# EAGLE design Qwiic_Differential_Pressure_Sensor-SDP31 (EAGLE 9.6.2)
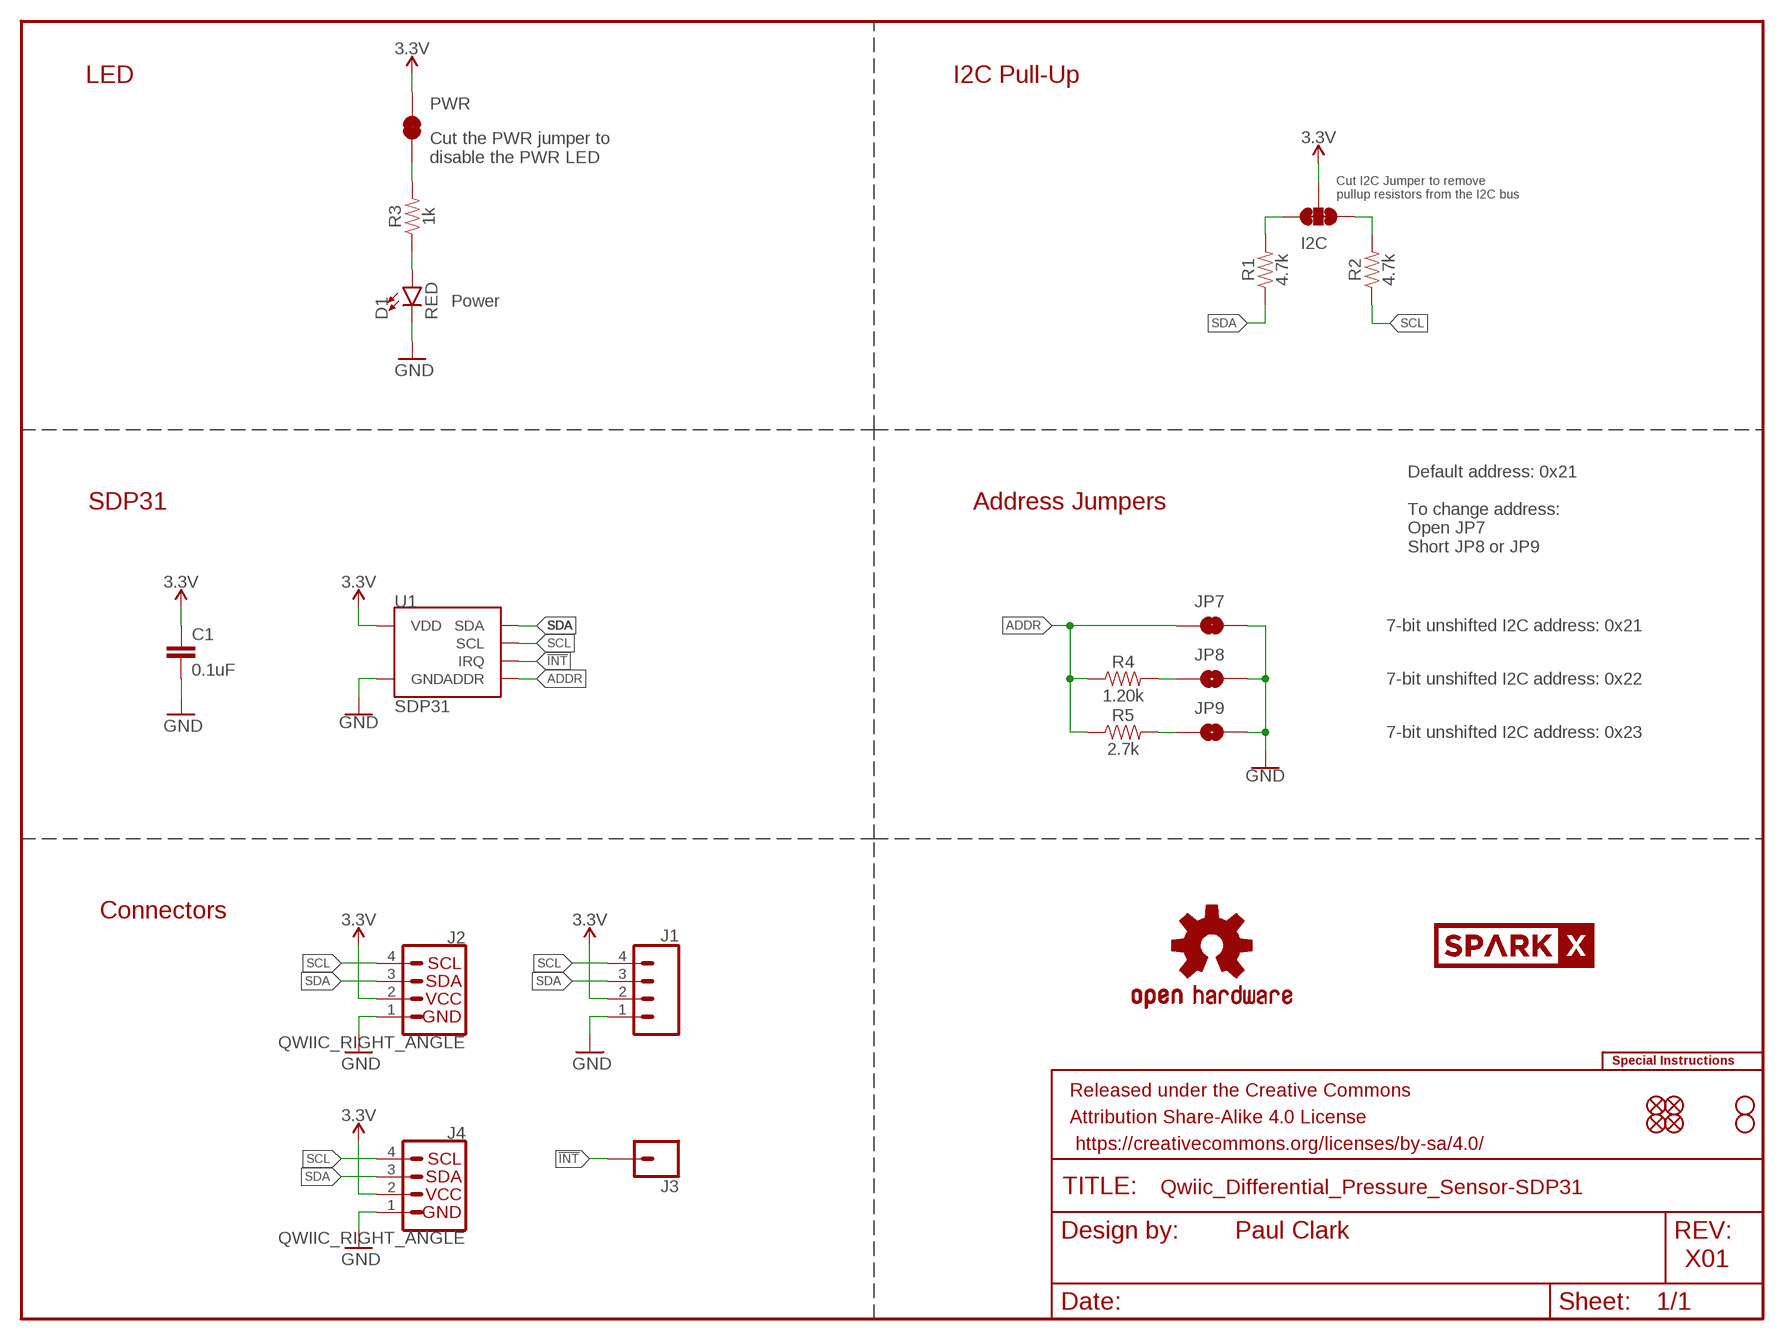
[diagram p0: schematic, sheet 1]

## Parts
C1  0.1uF  0.1UF-0603-25V-(+80/-20%)  [0603]
D1  RED  LED-RED0603  [LED-0603]
FRAME1  FRAME-LETTER  [CREATIVE_COMMONS]
I2C  JUMPER-SMT_3_2-NC_TRACE_SILK  [SMT-JUMPER_3_2-NC_TRACE_SILK]
J1  CONN_041X04_NO_SILK  [1X04_NO_SILK]
J2  QWIIC_RIGHT_ANGLE  QWIIC_CONNECTORJS-1MM  [JST04_1MM_RA]
J3  CONN_01PTH_NO_SILK_YES_STOP  [1X01_NO_SILK]
J4  QWIIC_RIGHT_ANGLE  QWIIC_CONNECTORJS-1MM  [JST04_1MM_RA]
JP1  FIDUCIALUFIDUCIAL  [FIDUCIAL-MICRO]
JP2  FIDUCIALUFIDUCIAL  [FIDUCIAL-MICRO]
JP3  STAND-OFF  [STAND-OFF]
JP4  STAND-OFF  [STAND-OFF]
JP5  FIDUCIALUFIDUCIAL  [FIDUCIAL-MICRO]
JP6  FIDUCIALUFIDUCIAL  [FIDUCIAL-MICRO]
JP7  JUMPER-SMT_2_NC_TRACE_SILK  [SMT-JUMPER_2_NC_TRACE_SILK]
JP8  JUMPER-SMT_2_NO_SILK  [SMT-JUMPER_2_NO_SILK]
JP9  JUMPER-SMT_2_NO_SILK  [SMT-JUMPER_2_NO_SILK]
LOGO1  SPECIAL_INSTRUCTIONS-ORDERING  [ORDERING_INSTRUCTIONS]
LOGO5  OSHW-LOGOS  [OSHW-LOGO-S]
PWR  JUMPER-SMT_2_NC_TRACE_SILK  [SMT-JUMPER_2_NC_TRACE_SILK]
R1  4.7k  4.7KOHM-0603-1/10W-1%  [0603]
R2  4.7k  4.7KOHM-0603-1/10W-1%  [0603]
R3  1k  1KOHM-0603-1/10W-1%  [0603]
R4  1.20k  1.20KOHM-0603-1/10W-1%  [0603]
R5  2.7k  2.7KOHM-0603-1/10W-1%  [0603]
U1  SDP31  SDP3X_SDP31  [SDP3X]
U$18  SPARKX-LOGO3  [SPARKX-SMALL]

## Nets
3.3V: C1.1 I2C.2 J1.2 J2.2 J4.2 PWR.2 U1.7(VDD)
!INT!: J3.1 U1.4(IRQ)
ADDR: JP7.1 R4.1 R5.1 U1.9(ADDR)
GND: C1.2 D1.C J1.1 J2.1 J4.1 JP7.2 JP8.2 JP9.2 U1.1(GND) U1.2(GND) U1.3(GND) U1.6(GND) U1.10(GND) U1.11(GND) U1.DIEPAD1(GND) U1.DIEPAD2(GND)
N$1: PWR.1 R3.2
N$2: I2C.3 R1.2
N$3: D1.A R3.1
N$4: I2C.1 R2.2
N$5: JP8.1 R4.2
N$6: JP9.1 R5.2
SCL: J1.4 J2.4 J4.4 R2.1 U1.5(SCL)
SDA: J1.3 J2.3 J4.3 R1.1 U1.8(SDA)

## Notes on the sheet
- LED | I2C Pull-Up
- Cut the PWR jumper to
  disable the PWR LED
- Cut I2C Jumper to remove 
  pullup resistors from the I2C bus
- Power
- Default address: 0x21
  
  To change address:
  Open JP7
  Short JP8 or JP9
- SDP31 | Address Jumpers
- 7-bit unshifted I2C address: 0x21
- 7-bit unshifted I2C address: 0x22
- 7-bit unshifted I2C address: 0x23
- Connectors
- Paul Clark
- X01

## Library data of the parts
C1 = SparkFun-Capacitors:0.1UF: 0.1µF ceramic capacitors A capacitor is a passive two-terminal electrical component used to store electrical energy temporarily in an electric field.; PROD_ID: CAP-00810
D1 = SparkFun-LED:LED-RED: Red SMD LED Used in manufacturing of most products at SparkFun Packages: 0603 - SMD 0603 package [Product Link] <http://docs.avagotech.com/docs/AV02-0551EN> 0603 SMART - SMD 0603 SMART package ( more efficient and expensive)[Product Link] <http://www.osram-os.com/Graphics/XPic2/00077099_0.pdf> 1206 - SMD1206 package [Product Link] <https://www.sparkfun.com/datasheets/DevTools/LilyPad/Q150OVS4.pdff> SparkFun Products: Pro Mini 328 -5V <https://www.sparkfun.com/products/821> RedBoard <https://www.sparkfun.com/products/12757> IOIO-OTG <https://www.sparkfun.com/products/13613>; PROD_ID: DIO-00819
FRAME1 = SparkFun-Aesthetics:FRAME-LETTER: Schematic Frame - Letter Standard 8.5x11 US Letter frame
I2C = SparkFun-Jumpers:JUMPER-SMT_3_2-NC_TRACE: Normally closed trace jumper (2 of 2 connections) This jumper has a trace between all three pads so they are normally closed (NC). Use a razor knife to open the connection(s). For best results follow the IPC guidelines for cutting traces: Cutout at least 0.063 mm (0.005 in). Remove all loose material to clean up the cut area. Seal the cut with an approved epoxy. Reapply solder to reclose the connection(s).
J1 = SparkFun-Connectors:CONN_04: Multi connection point. Often used as Generic Header-pin footprint for 0.1 inch spaced/style header connections On any of the 0.1 inch spaced packages, you can populate with these: Break Away Headers - Straight <https://www.sparkfun.com/products/116> (PRT-00116) Break Away Male Headers - Right Angle <https://www.sparkfun.com/products/553> (PRT-00553) Female Headers <https://www.sparkfun.com/products/115> (PRT-00115) Break Away Headers - Machine Pin <https://www.sparkfun.com/products/117> (PRT-00117) Break Away Female Headers - Swiss Machine Pin <https://www.sparkfun.com/products/743> (PRT-00743) For SCREWTERMINALS and SPRING TERMINALS visit here: Screw Terimnals on SparkFun.com <https://www.sparkfun.com/search/results?term=Screw+Terminals> (5mm/3.5mm/2.54mm spacing) This device is also useful as a general connection point to wire up your design to another part of your project. Our various solder wires solder well into these plated through hole pads. Hook-Up Wire - Assortment (Stranded, 22 AWG) <https://www.sparkfun.com/products/11375> (PRT-11375) Hook-Up Wire - Assortment (Solid Core, 22 AWG) <https://www.sparkfun.com/products/11367> (PRT-11367) View the entire wire category on our website here <https://www.sparkfun.com/categories/141> Special notes: Molex polarized connector foot print use with SKU : PRT-08231 with associated crimp pins and housings. 1MM SMD Version SKU: PRT-10208; PROD_ID: CONN-09696
J2 J4 = SparkFun-Connectors:QWIIC_CONNECTOR: SparkFun I2C Standard Qwiic Connector An SMD 1mm pitch JST connector makes it easy and quick (get it? Qwiic?) to connect I2C devices to each other. The Qwiic system <http://www.sparkfun.com/qwiic> enables fast and solderless connection between popular platforms and various sensors and actuators. We carry 200mm <https://www.sparkfun.com/products/14204>, 100mm <https://www.sparkfun.com/products/14205>, 50mm <https://www.sparkfun.com/products/14206>, and breadboard friendly <https://www.sparkfun.com/products/14207> Qwiic cables. We also offer 10 pcs strips <https://www.sparkfun.com/products/14323> the SMD connectors.; PROD_ID: CONN-13694
J3 = SparkFun-Connectors:CONN_01: Single connection point. Often used as Generic Header-pin footprint for 0.1 inch spaced/style header connections On any of the 0.1 inch spaced packages, you can populate with these: Break Away Headers - Straight <https://www.sparkfun.com/products/116> (PRT-00116) Break Away Male Headers - Right Angle <https://www.sparkfun.com/products/553> (PRT-00553) Female Headers <https://www.sparkfun.com/products/115> (PRT-00115) Break Away Headers - Machine Pin <https://www.sparkfun.com/products/117> (PRT-00117) Break Away Female Headers - Swiss Machine Pin <https://www.sparkfun.com/products/743> (PRT-00743) This device is also useful as a general connection point to wire up your design to another part of your project. Our various solder wires solder well into these plated through hole pads. Hook-Up Wire - Assortment (Stranded, 22 AWG) <https://www.sparkfun.com/products/11375> (PRT-11375) Hook-Up Wire - Assortment (Solid Core, 22 AWG) <https://www.sparkfun.com/products/11367> (PRT-11367) View the entire wire category on our website here <https://www.sparkfun.com/categories/141> Special notes: SMTSO-256-ET is a "flush mount" nut for a 4-40 screw. We mostly use this on specialty testbeds; it is a nice way to connect hardware to your PCB at an adjustable hieght. Also note, the SNAP packages are for using a snappable style connector. We sell a baggie of snaps and they are also used on two LilyPad designs: Snap Assortment - 30 pack (male and female) <https://www.sparkfun.com/products/11347> (DEV-11347) LilyPad Arduino SimpleSnap <https://www.sparkfun.com/products/10941> (DEV-10941) LilyPad SimpleSnap Protoboard <https://www.sparkfun.com/products/10940> (DEV-10940)
JP1 JP2 JP5 JP6 = SparkFun-Aesthetics:FIDUCIAL: Fiducial Alignment Points Point-of-reference for pick-and-place machines and other optical instruments.
JP3 JP4 = SparkFun-Hardware:STAND-OFF: Stand Off Drill holes for mechanically mounting via screws, standoffs, etc. Note: Use the keepout ring to avoid running the screw head into surrounding components. Variant Overviews STAND-OFF - Mechanical footprint for a #4 phillips button head screw. STAND-OFF-TIGHT - Mechanical footprint for a #4 phillips button head screw, Example SparkFun Products Screw - Phillips Head (1/4", 4-40, 10 pack) <https://www.sparkfun.com/products/10453> (PRT-10453) Screw - Phillips Head (1/2", 4-40, 10 pack) <https://www.sparkfun.com/products/10452> (PRT-10452) Screw - Phillips Head (3/4", 4-40, 10 pack) <https://www.sparkfun.com/products/10451> (PRT-10451) Screw - Phillips Head (1", 4-40, 10 pack) <https://www.sparkfun.com/products/10450> (PRT-10450)
JP7 PWR = SparkFun-Jumpers:JUMPER-SMT_2_NC_TRACE: Normally closed trace jumper This jumper has a trace between two pads so it's normally closed (NC). Use a razor knife to open the connection. For best results follow the IPC guidelines for cutting traces: Cutout at least 0.063 mm (0.005 in). Remove all loose material to clean up the cut area. Seal the cut with an approved epoxy. Reapply solder to reclose the connection.
JP8 JP9 = SparkFun-Jumpers:JUMPER-SMT_2_NO: Normally open jumper This jumper has two pads in close proximity to each other. Apply solder to close the connection. Round pads are easier to solder for beginners, but are a lot larger. SparkFun Product that uses the round pads: SparkFun EL Sequencer <https://www.sparkfun.com/products/12781>
LOGO1 = SparkFun-Aesthetics:SPECIAL_INSTRUCTIONS: Special Ordering/Production Instructions Alert Symbol for special PCB ordering instructions or unique production process warnings. Ordering Instructions Production Instructions Types of information that should be added to box: Copper weight Soldermask color Silk color PCB thickness Number of layers PCB Standard: 1.6mm FR4 1 oz copper immersion silver plating red soldermask white silkscreen Types of information that should be added to box: Special wash requirements Depaneling instructions Humidification Glue curing Default text settings: 0.07 inch 9% ratio 50% line distance
LOGO5 = SparkFun-Aesthetics:OSHW-LOGO: Open-Source Hardware (OSHW) Logo This logo indicates the piece of hardware it is found on incorporates a OSHW license and/or adheres to the definition of open source hardware found here: http://freedomdefined.org/OSHW
R1 R2 = SparkFun-Resistors:4.7KOHM: 4.7kΩ resistor A resistor is a passive two-terminal electrical component that implements electrical resistance as a circuit element. Resistors act to reduce current flow, and, at the same time, act to lower voltage levels within circuits. - Wikipedia; PROD_ID: RES-07857
R3 = SparkFun-Resistors:1KOHM: 1kΩ resistor A resistor is a passive two-terminal electrical component that implements electrical resistance as a circuit element. Resistors act to reduce current flow, and, at the same time, act to lower voltage levels within circuits. - Wikipedia; PROD_ID: RES-07856
R4 = SparkFun-Resistors:1.20KOHM: 1.20kΩ resistor A resistor is a passive two-terminal electrical component that implements electrical resistance as a circuit element. Resistors act to reduce current flow, and, at the same time, act to lower voltage levels within circuits. - Wikipedia; PROD_ID: RES-08413
R5 = SparkFun-Resistors:2.7KOHM: 2.7kΩ resistor A resistor is a passive two-terminal electrical component that implements electrical resistance as a circuit element. Resistors act to reduce current flow, and, at the same time, act to lower voltage levels within circuits. - Wikipedia; PROD_ID: RES-16714
U1 = SparkFun-Sensors:SDP3X: Differential Pressure Sensor SDP3x The World's Smallest Differential Pressure Sensor The SDP3x is the world's smallest differential pressure sensor. It measures just 5 mm x 8 mm x 5 mm, opening up new dimensions of integration and application possibilities. The sensor is based on the next generation of the CMOSens® sensor chip and is the heart of Sensirion's new sensor platform for measuring differential pressure and mass flow.; PROD_ID: IC-15720
U$18 = SparkX:SPARKX-LOGO

## Net classes
1 power: width 0.203 mm

## Board
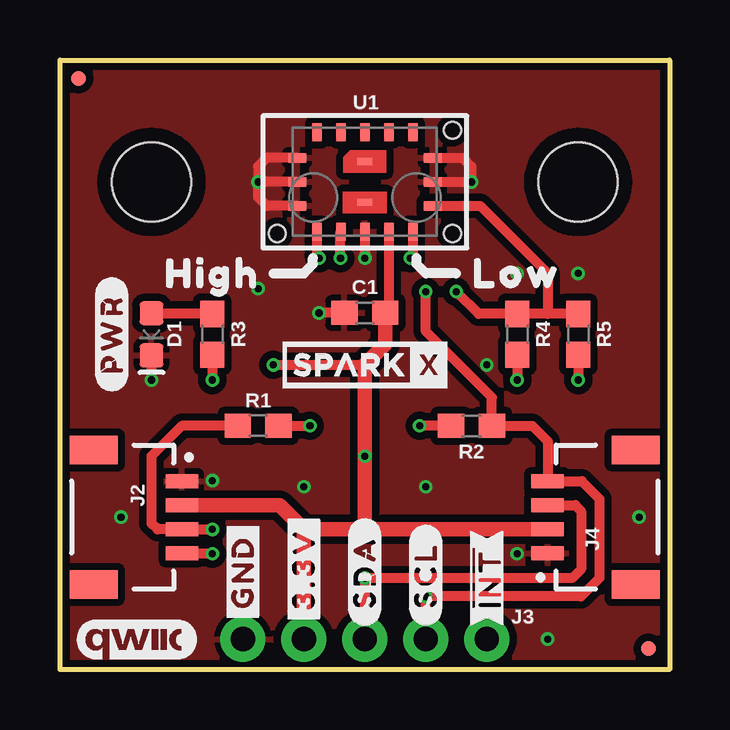
[diagram p1: board, top side]
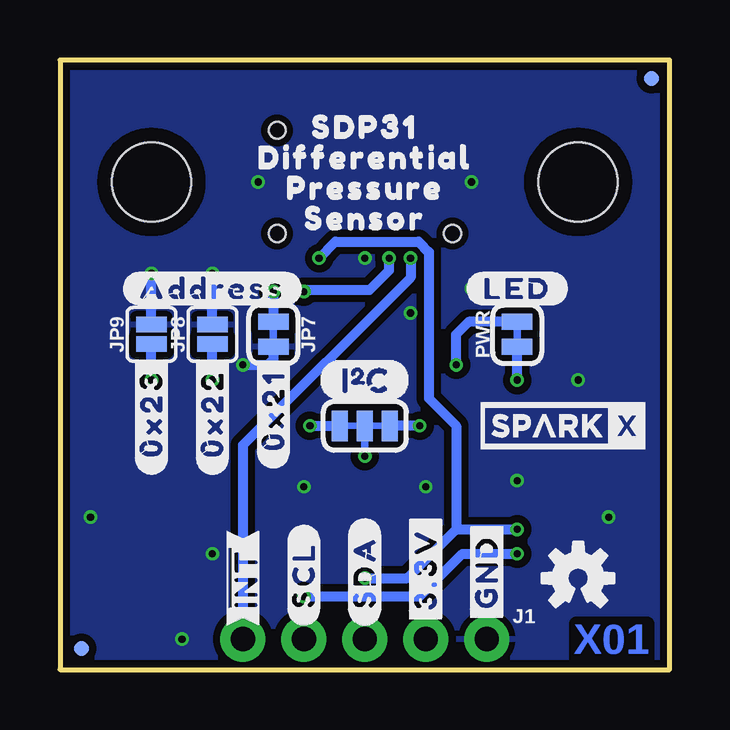
[diagram p2: board, bottom side, seen from below]

Size 25.4 x 25.4 mm. Coordinates in mm from the lower left corner, seen from the top.
Outline: 0,0 0,25.4 25.4,25.4 25.4,0 0,0
Copper layers (1+2*15+16): Top 0.035mm / dielectric 0.2mm / Route2 0.0175mm / dielectric 1.065mm / Route15 0.0175mm / dielectric 0.2mm / Bottom 0.035mm
Design rules "SparkFun-4-layer-1oz-JLCPCB": minimum track width 5mil, minimum drill 0.2mm, track to track 5mil, track to pad 0.2mm, pad to pad 5mil, via to via 0.2mm, smd to smd 0mil, copper to edge 0.2mm, drill to drill 10mil, minimum pad ring 0.13mm, minimum via ring 0.13mm, stop-mask expansion 0.05mm, vias tented up to drill 25mil, thermal gap 10mil

### Footprints (pad centres in the part's own frame; a part is rotated, then mirrored left to right if it is on the bottom)
0603 = smd 1.1 x 1: 1 -0.85,0; 2 0.85,0
LED-0603 = smd 1 x 1: A -0.877,0; C 0.877,0
SMT-JUMPER_3_2-NC_TRACE_SILK = smd 0.66 x 1.27: 1 -1.041,0; 2 0,0; 3 1.041,0
1X04_NO_SILK = drill 1.016 pad 1.88: 1 0,0; 2 2.54,0; 3 5.08,0; 4 7.62,0
JST04_1MM_RA = smd 0.6 x 1.35: 1 -1.5,0; 2 -0.5,0; 3 0.5,0; 4 1.5,0 | smd 1.2 x 2: NC1 2.8,-3.675; NC2 -2.8,-3.675
1X01_NO_SILK = drill 1.016 pad 1.88: 1 0,0
FIDUCIAL-MICRO = smd 0.635 x 0.635: 1 0,0
STAND-OFF = hole 3.302: 0,0
SMT-JUMPER_2_NC_TRACE_SILK = smd 0.66 x 1.27: 1 -0.521,0; 2 0.521,0
SMT-JUMPER_2_NO_SILK = smd 0.635 x 1.27: 1 -0.406,0; 2 0.406,0
SDP3X = smd 0.75 x 0.4: 1 -2.825,1; 2 -2.825,0; 3 -2.825,-1; 9 2.825,-1; 10 2.825,0; 11 2.825,1 | smd 0.4 x 0.75: 4 -2,-2.075; 5 -1,-2.075; 6 0,-2.075; 7 1,-2.075; 8 2,-2.075; 12 2,2.075; 13 1,2.075; 14 0,2.075; 15 -1,2.075; 16 -2,2.075 | smd 0.61 x 0.305: DIEPAD1 0,0.85; DIEPAD2 0,-0.85 | hole 0.7: -3.65,-2.15; 3.65,-2.15; 3.65,2.15

### Placement (x,y rotation side)
C1  12.7,14.86 180 top
D1  3.81,13.97 270 top
FRAME1  62.23,-13.97 0 top  (outside the outline)
I2C  12.7,10.16 0 bottom
J1  7.62,1.27 180 bottom
J2  5.08,6.35 270 top
J3  17.78,1.27 0 top
J4  20.32,6.35 90 top
JP1  0.76,24.64 0 bottom
JP2  24.51,0.89 0 top
JP3  3.81,20.32 0 top
JP4  21.59,20.32 0 top
JP5  24.51,0.89 0 bottom
JP6  0.76,24.64 0 top
JP7  16.51,13.97 270 bottom
JP8  19.05,13.97 90 bottom
JP9  21.59,13.97 90 bottom
LOGO1  41.91,45.72 0 top  (outside the outline)
LOGO5  3.81,3.81 0 bottom
PWR  6.35,13.97 90 bottom
R1  8.26,10.16 0 top
R2  17.14,10.16 180 top
R3  6.35,13.97 270 top
R4  19.05,13.97 270 top
R5  21.59,13.97 270 top
U1  12.7,20.32 0 top
U$1  [#GND#0]  7.62,4.06 90 bottom
U$2  [#3#3V#0]  10.16,4.19 90 bottom
U$3  [#SDA#0]  12.7,4.06 90 bottom
U$4  [#SCL#0]  15.24,3.94 90 bottom
U$5  [##INT##0]  17.78,3.81 90 top
U$6  [##INT##0]  17.78,3.81 90 bottom
U$7  [#0X21#0]  16.51,10.79 90 bottom
U$8  [#0X22#0]  19.05,10.67 90 bottom
U$9  [#0X23#0]  21.59,10.67 90 bottom
U$10  [DIFFERENTIAL0]  12.7,21.34 0 bottom
U$11  [PRESSURE0]  12.7,20.07 0 bottom
U$12  [SENSOR0]  12.7,18.8 0 bottom
U$13  [SDP310]  12.7,22.61 0 bottom
U$14  [#LED#0]  6.35,15.88 0 bottom
U$15  [I2C]  14.61,12.06 0 bottom
U$16  [QWIIC_5MM]  3.17,1.27 0 top
U$17  [HIGH0]  6.35,16.51 0 top
U$18  4.45,10.16 0 bottom
U$19  [LOW0]  19.05,16.51 0 top
U$20  SPARKX-LOGO3  [SPARKX-SMALL]  12.7,12.7 0 top
U$21  [#ADDRESS#0]  19.05,15.88 0 bottom
U$32  [#PWR#0]  2.16,13.97 90 top
U$33  [#GND#0]  7.62,4.06 90 top
U$34  [#3#3V#0]  10.16,4.19 90 top
U$35  [#SDA#0]  12.7,4.06 90 top
U$36  [#SCL#0]  15.24,3.94 90 top

### Tracks (layer width: path | path; a pad name or v marks a point on that pad's centre or on a via)
3.3V  (via drill 0.3)
  Top 0.406: v8.89,12.7 12.7,12.7 | U1.7 13.7,15.01 C1.1
  Top 0.61: J2.2 9.15,6.85 10.15,5.85 | 10.15,5.85 12.7,5.85 | 12.7,5.85 J4.2 | J1.2 10.16,5.84 10.15,5.85 | C1.1 13.55,13.55 12.7,12.7 v12.7,8.89 12.7,5.85
  Bottom 0.305: I2C.2 v12.7,8.89
  Bottom 0.406: PWR.2 8.37,14.49 8.89,13.97 v8.89,12.7
!INT!  (via drill 0.3)
  Top 0.406: U1.4 10.7,17.24 v10.79,17.14
  Bottom 0.406: J3.1 17.78,9.35 10.79,16.33 v10.79,17.14
ADDR  (via drill 0.3)
  Top 0.406: U1.9 17.51,19.32 20.32,16.51 20.32,14.82 | R5.1 20.32,14.82 | 20.32,14.82 R4.1 17.44,14.82 v16.51,15.75
  Bottom 0.406: v16.51,15.75 JP7.1
GND  (via drill 0.3)
  Top 0.406: U1.10 v17.14,20.32 17.14,20.95 16.78,21.32 U1.11 | U1.2 v8.26,20.32 | U1.1 8.62,21.32 8.26,20.95 v8.26,20.32 | U1.3 8.62,19.32 8.26,19.68 v8.26,20.32 | U1.6 v12.7,17.14 | D1.C v3.81,12.06 | C1.2 v10.79,14.86
  Bottom 0.406: JP8.2 v19.05,16.51 | JP9.2 v21.59,16.51 | v17.78,12.7 16.75,12.7 16.51,12.94 JP7.2
  other vias: 19.05,4.83 6.35,7.87 8.26,15.88 2.54,6.35 24.13,6.35 20.32,1.27 15.24,7.62 10.16,7.62
  pour Bottom (isolate 0.305): 0,0 0,25.4 25.4,25.4 25.4,0
  pour Top (isolate 0.305): 0,0 0,25.4 25.4,25.4 25.4,0
N$1  (via drill 0.3)
  Top 0.406: R3.2 v6.35,12.06
  Bottom 0.406: v6.35,12.06 PWR.1
N$2  (via drill 0.3)
  Top 0.406: R1.2 v10.41,10.16
  Bottom 0.406: v10.41,10.16 I2C.3
N$3
  Top 0.406: D1.A 6.32,14.85 R3.1
N$4  (via drill 0.3)
  Top 0.406: R2.2 v14.99,10.16
  Bottom 0.406: v14.99,10.16 I2C.1
N$5  (via drill 0.3)
  Top 0.406: R4.2 v19.05,12.06
  Bottom 0.406: v19.05,12.06 JP8.1
N$6  (via drill 0.3)
  Top 0.406: R5.2 v21.59,12.06
  Bottom 0.406: v21.59,12.06 JP9.1
SCL  (via drill 0.3)
  Top 0.406: v6.35,4.83 5.1,4.83 J2.4 | J1.4 v15.24,3.05 21.72,3.05 22.48,3.81 22.48,7.11 21.74,7.85 J4.4 20.32,9.53 19.68,10.16 R2.1 18,11.34 15.24,14.1 v15.24,15.75 | v11.68,17.14 11.68,18.23 U1.5
  Bottom 0.406: v15.24,3.05 10.41,3.05 8.64,4.83 v6.35,4.83 | v15.24,15.75 15.16,15.83 12.49,15.83 11.68,16.64 v11.68,17.14
SDA  (via drill 0.3)
  Top 0.305: J2.3
  Top 0.406: R1.1 5.08,10.16 3.81,8.89 3.81,6.1 4.06,5.84 J2.3 | J2.3 v6.34,5.85 v6.35,5.84 | J4.3 21.47,6.85 21.72,6.6 21.72,4.19 21.34,3.81 v12.7,3.81 J1.3 | U1.8 14.7,17.24 v14.61,17.14
  Bottom 0.406: v12.7,3.81 10.92,3.81 8.89,5.84 | 8.89,5.84 v6.35,5.84 | v14.61,17.14 13.92,17.83 10.46,17.83 10.03,17.4 10.03,11.3 8.89,10.16 8.89,5.84

### Text on the board
Bottom: X01
Measures: Ø3.3mm | Dimensions in inches / except where indicated
tDocu: 2 Layers / 1.6mm Thickness / HASL Finish | Paul Clark